# EasyEDA Pro project 4046.epro

# Schematic Schematic1
Board Name: Board1; Create Date: 2025-07-21
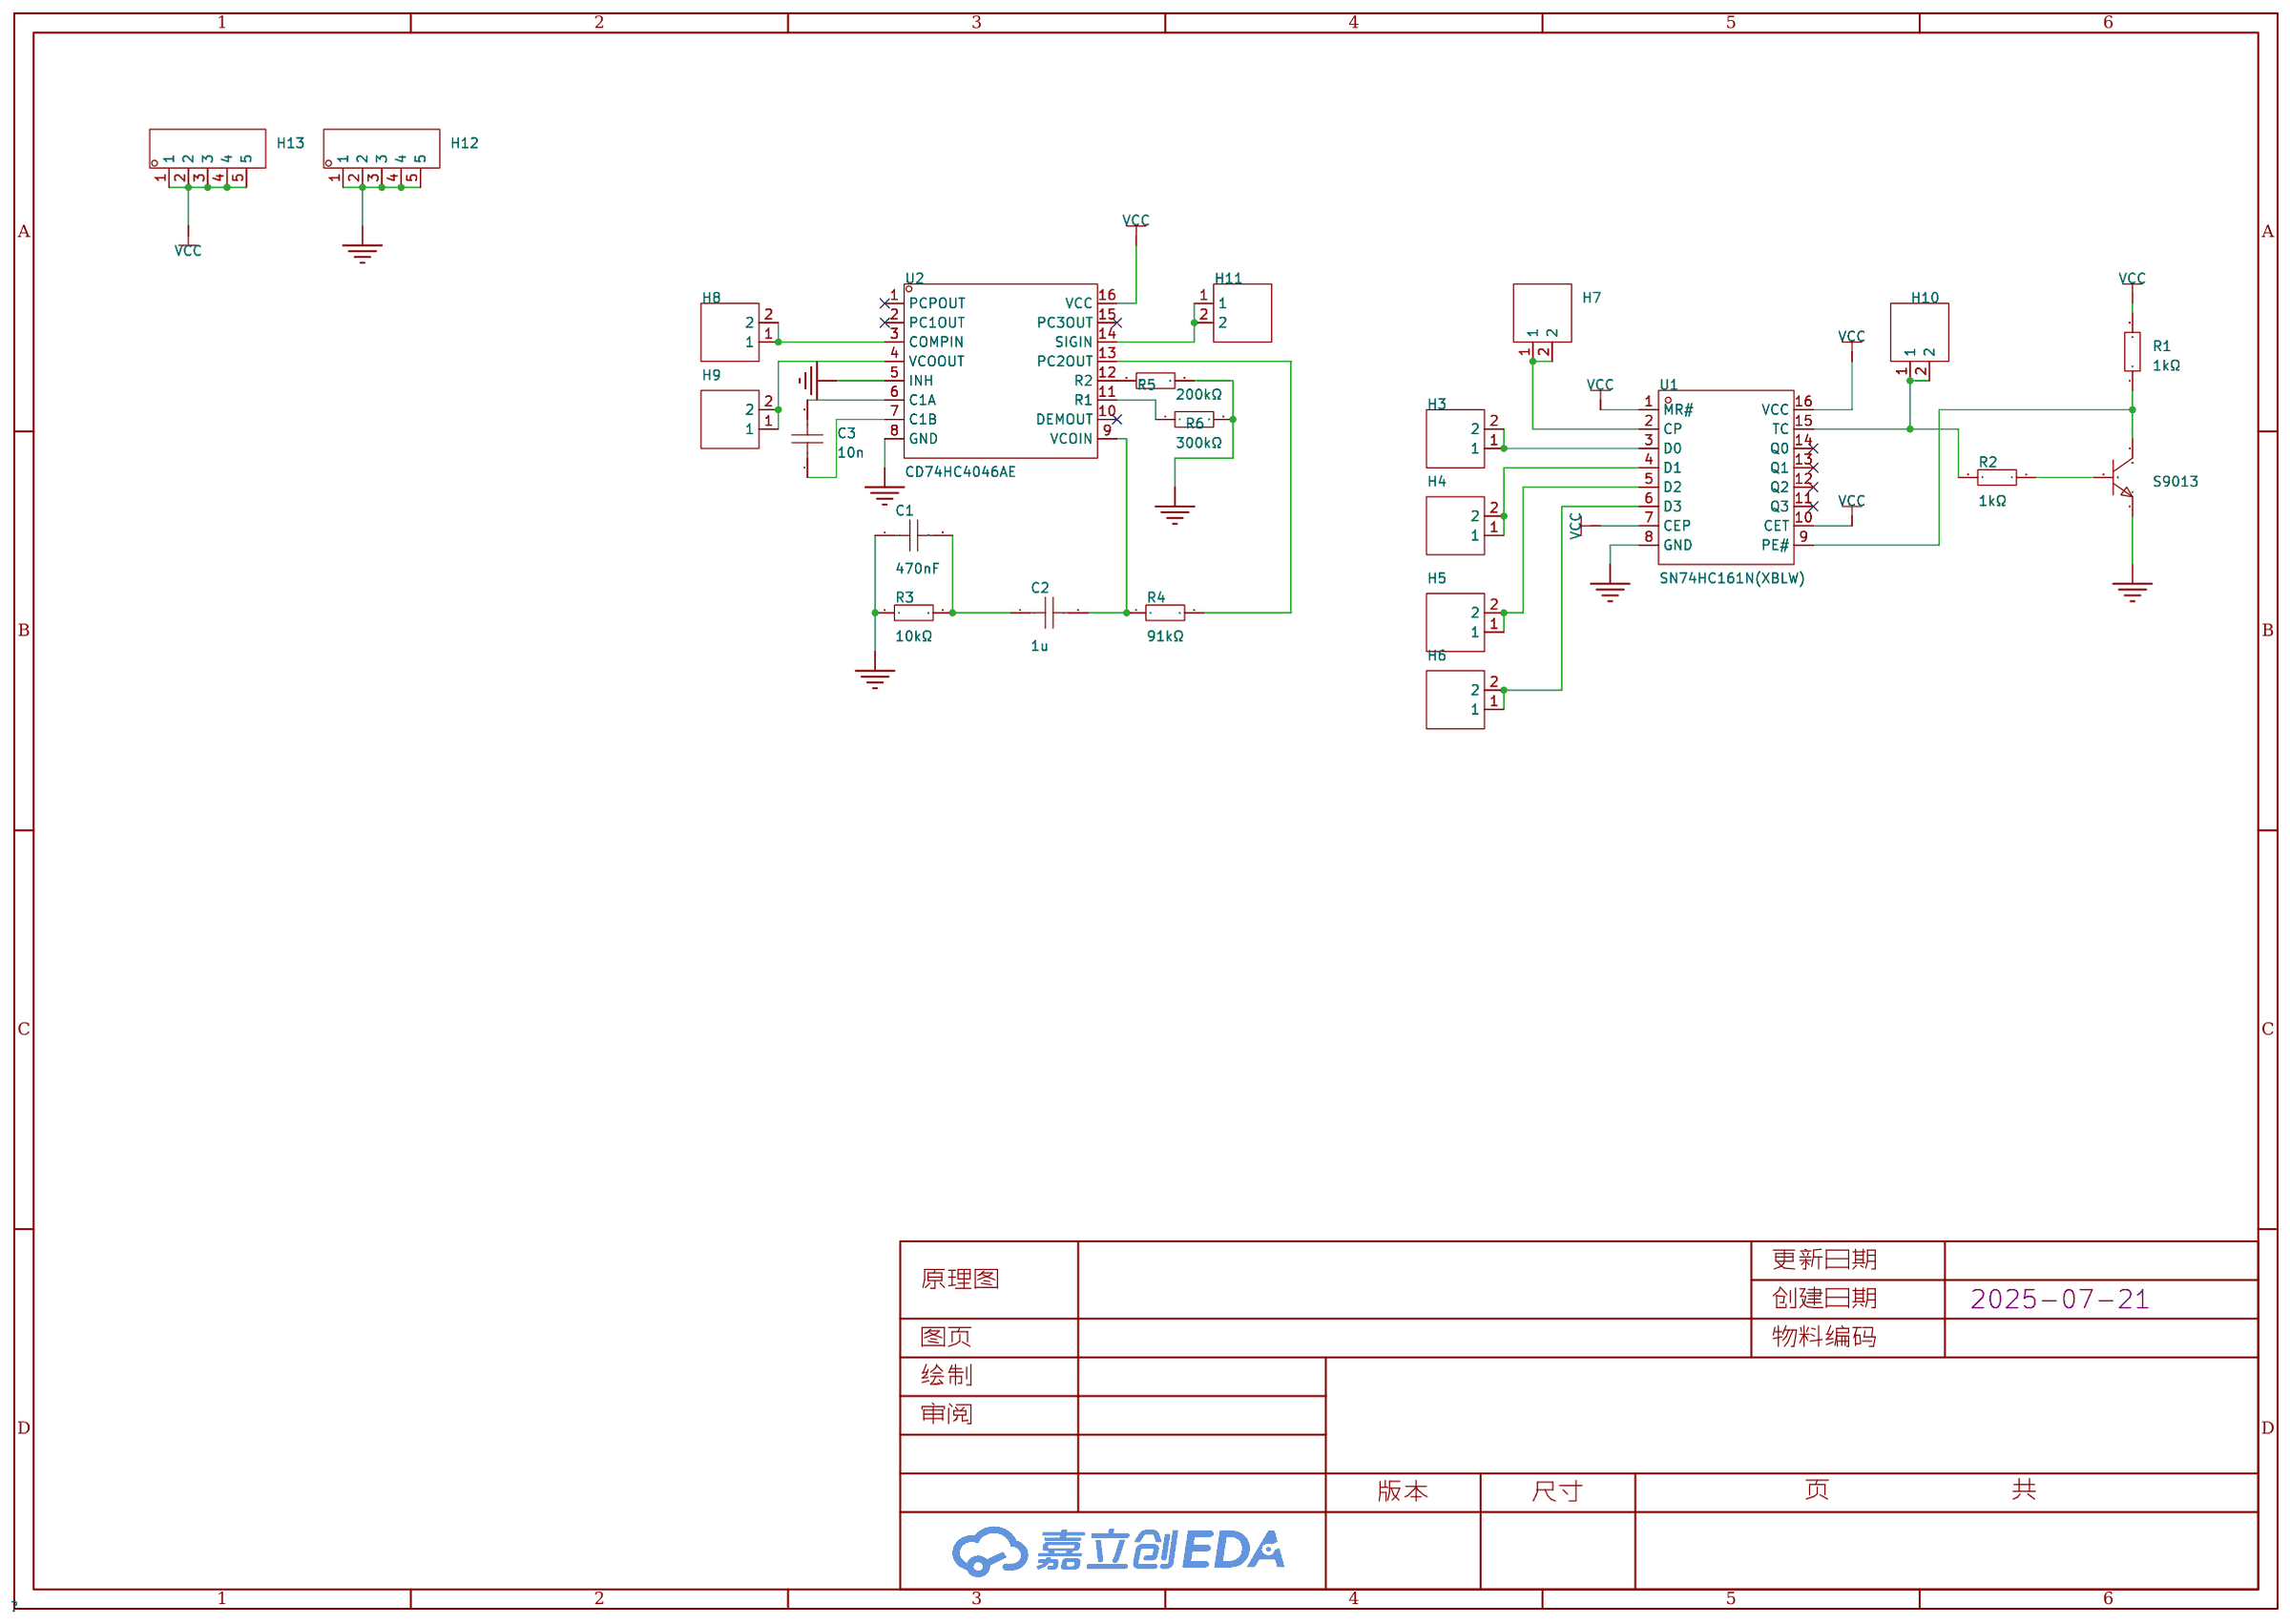
[diagram p0: schematic sheet]

## Parts
C1  470nF  [CAP-TH_L8.5-W5.0-P5.00-D1.2]
C2  1u  [CAP-TH_L8.5-W5.0-P5.00-D1.2]
C3  10n  [CAP-TH_L8.5-W5.0-P5.00-D1.2]
H3  -  [HDR-TH_2P-P2.54-V-M-1]
H4  -  [HDR-TH_2P-P2.54-V-M-1]
H5  -  [HDR-TH_2P-P2.54-V-M-1]
H6  -  [HDR-TH_2P-P2.54-V-M-1]
H7  -  [HDR-TH_2P-P2.54-V-M-1]
H8  -  [HDR-TH_2P-P2.54-V-M-1]
H9  -  [HDR-TH_2P-P2.54-V-M-1]
H10  -  [HDR-TH_2P-P2.54-V-M-1]
H11  -  [HDR-TH_2P-P2.54-V-M-1]
H12  -  [HDR-TH_5P-P2.54-V-M]
H13  -  [HDR-TH_5P-P2.54-V-M]
Q1  S9013  [TO-92-3_L4.5-W3.5-P1.27-L]
R1  1kΩ  [Res_1/8W]
R2  1kΩ  [Res_1/8W]
R3  10kΩ  [Res_1/8W]
R4  91kΩ  [Res_1/8W]
R5  200kΩ  [Res_1/8W]
R6  300kΩ  [Res_1/8W]
U1  SN74HC161N(XBLW)  [PDIP-16_L19.3-W6.4-P2.54-LS7.9-BL]
U2  CD74HC4046AE  [PDIP-16_L22.1-W6.3-P2.54-LS7.6-BL]

## Library data of the parts
C1-C3 = CT4-0805B104K500F3: 容值:100nF;精度:±10%;额定电压:50V;温度系数:X7R;; LCSC Part Name: 100nF ±10% 50V C3型（直脚）; Supplier Part: C84772; Manufacturer: FH(风华); Supplier Footprint: 插件,P=5.08mm; JLCPCB Part Class: 扩展库; Datasheet: https://atta.szlcsc.com/upload/public/pdf/source/20190402/C385200_059806A6312B28FF1421A2413EB641E1.pdf; Supplier: LCSC; Tolerance: ±10%; Voltage Rated: 50V; Temperature Coefficient: X7R
H3-H11 = HDR-M_2.54_1x2P: Supplier Part: C124375; Supplier Footprint: 插件
H12 H13 = HDR-M_2.54_1x5P: Supplier Part: C358687; Supplier Footprint: 插件
Q1 = S9013_C20616377: 晶体管类型:NPN;集电极电流(Ic):500mA;直流电流增益(hFE):300;; Supplier Part: C20616377; Manufacturer: HXY MOSFET(华轩阳电子); Supplier Footprint: TO-92; JLCPCB Part Class: 扩展库; Datasheet: https://atta.szlcsc.com/upload/public/pdf/source/20240126/4945A79BF9631635E08AA694ACEE4CD1.pdf; Supplier: LCSC; type: NPN; Current - Collector(Ic): 500mA; DC Current Gain: 300; Transition frequency(fT): 150MHz
R1-R6 = Res_AXIAL-1/8W: Supplier Footprint: 轴向引线
U1 = SN74HC161N(XBLW): 工作电压:2V~6V;触发沿:上升沿;计数速率:48MHz;; LCSC Part Name: SN74HC161N; Supplier Part: C18723509; Manufacturer: XBLW(芯伯乐); Supplier Footprint: DIP-16; JLCPCB Part Class: 扩展库; Datasheet: https://atta.szlcsc.com/upload/public/pdf/source/20231019/E4ACCDE238F6D312E2887AAFD4BE47C0.pdf; Supplier: LCSC; Supply Voltage: 2V~6V; Trigger Type: 上升沿; Reset Style: 异步; Timing mode: 同步; Count Rate: 48MHz; Operating Temperature: -40℃~+105℃
U2 = CD74HC4046AE: 最大输出频率:38MHz;输出通道数:3;; LCSC Part Name: IC PLL W/VCO; Supplier Part: C354049; Manufacturer: TI(德州仪器); Supplier Footprint: PDIP-16; JLCPCB Part Class: 扩展库; Datasheet: https://www.ti.com/cn/lit/gpn/cd74hc4046a; Supplier: LCSC; Output Frequency(Max): 38MHz; Voltage - Supply: 2V~6V; Number of Outputs: 3; Operating Temperature: -55℃~+125℃

## Nets
GND: C1.1 H12.1 H12.2 H12.3 H12.4 H12.5 Q1.1(E) R3.1 R5.2 R6.2 U1.8(GND) U2.5(INH) U2.8(GND)
VCC: H13.1 H13.2 H13.3 H13.4 H13.5 R1.2 U1.1(MR#) U1.7(CEP) U1.10(CET) U1.16(VCC) U2.16(VCC)
$1N550: H3.1 H3.2 U1.3(D0)
$1N554: H4.1 H4.2 U1.4(D1)
$1N559: H5.1 H5.2 U1.5(D2)
$1N564: H6.1 H6.2 U1.6(D3)
$1N946: Q1.3(C) R1.1 U1.9(PE#)
$1N974: H10.1 H10.2 R2.2 U1.15(TC)
$1N1282: H7.1 H7.2 U1.2(CP)
$1N1371: H9.1 H9.2 U2.4(VCOOUT)
$1N1385: H8.1 H8.2 U2.3(COMPIN)
$1N1463: Q1.2(B) R2.1
$1N1636: C1.2 C2.1 R3.2
$1N1677: C2.2 R4.1 U2.9(VCOIN)
$1N1708: R4.2 U2.13(PC2OUT)
$1N1750: C3.2 U2.6(C1A)
$1N1754: C3.1 U2.7(C1B)
$1N1820: R5.1 U2.12(R2)
$1N1896: R6.1 U2.11(R1)
$1N1954: H11.1 H11.2 U2.14(SIGIN)

Not connected (* = marked no-connect by the designer): U1 11(Q3)* 12(Q2)* 13(Q1)* 14(Q0)*; U2 1(PCPOUT)* 2(PC1OUT)* 10(DEMOUT)* 15(PC3OUT)*

# Board PCB1
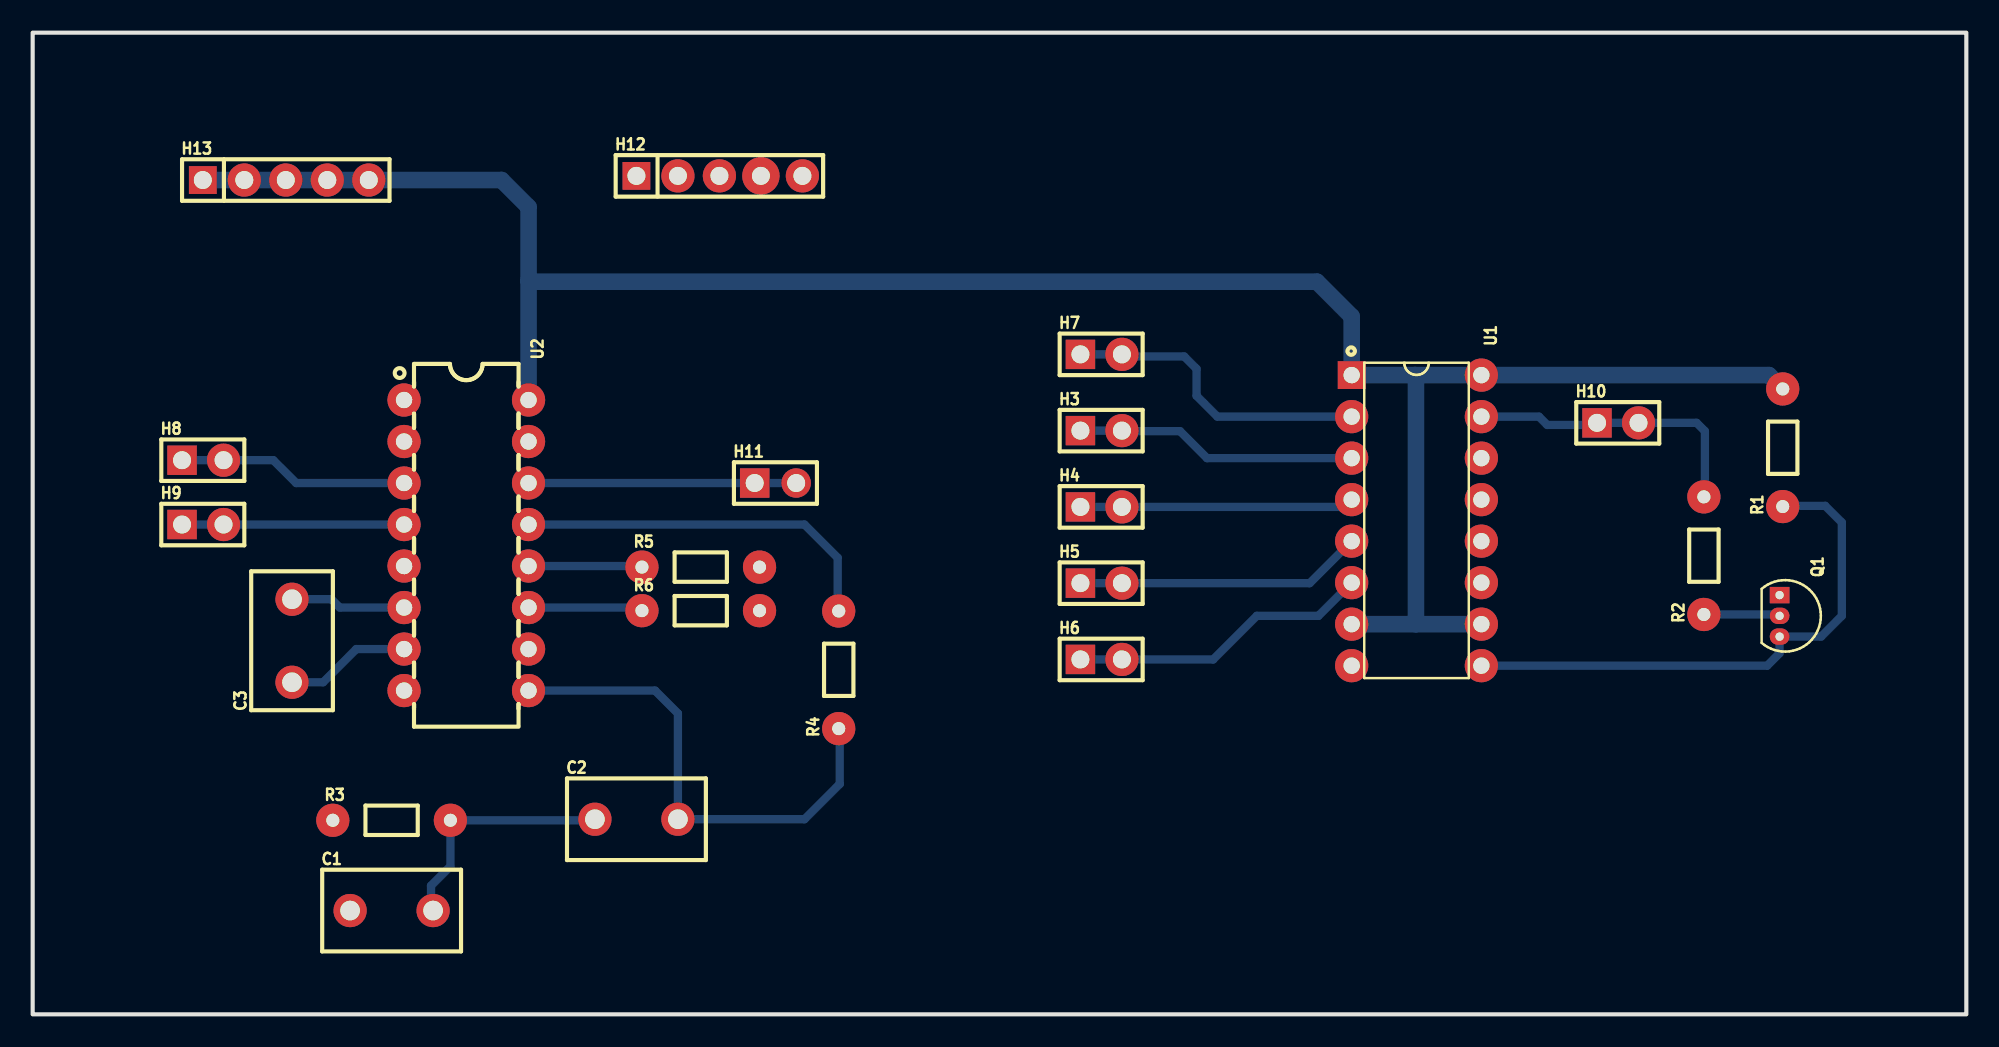
[diagram p1: board, top side]
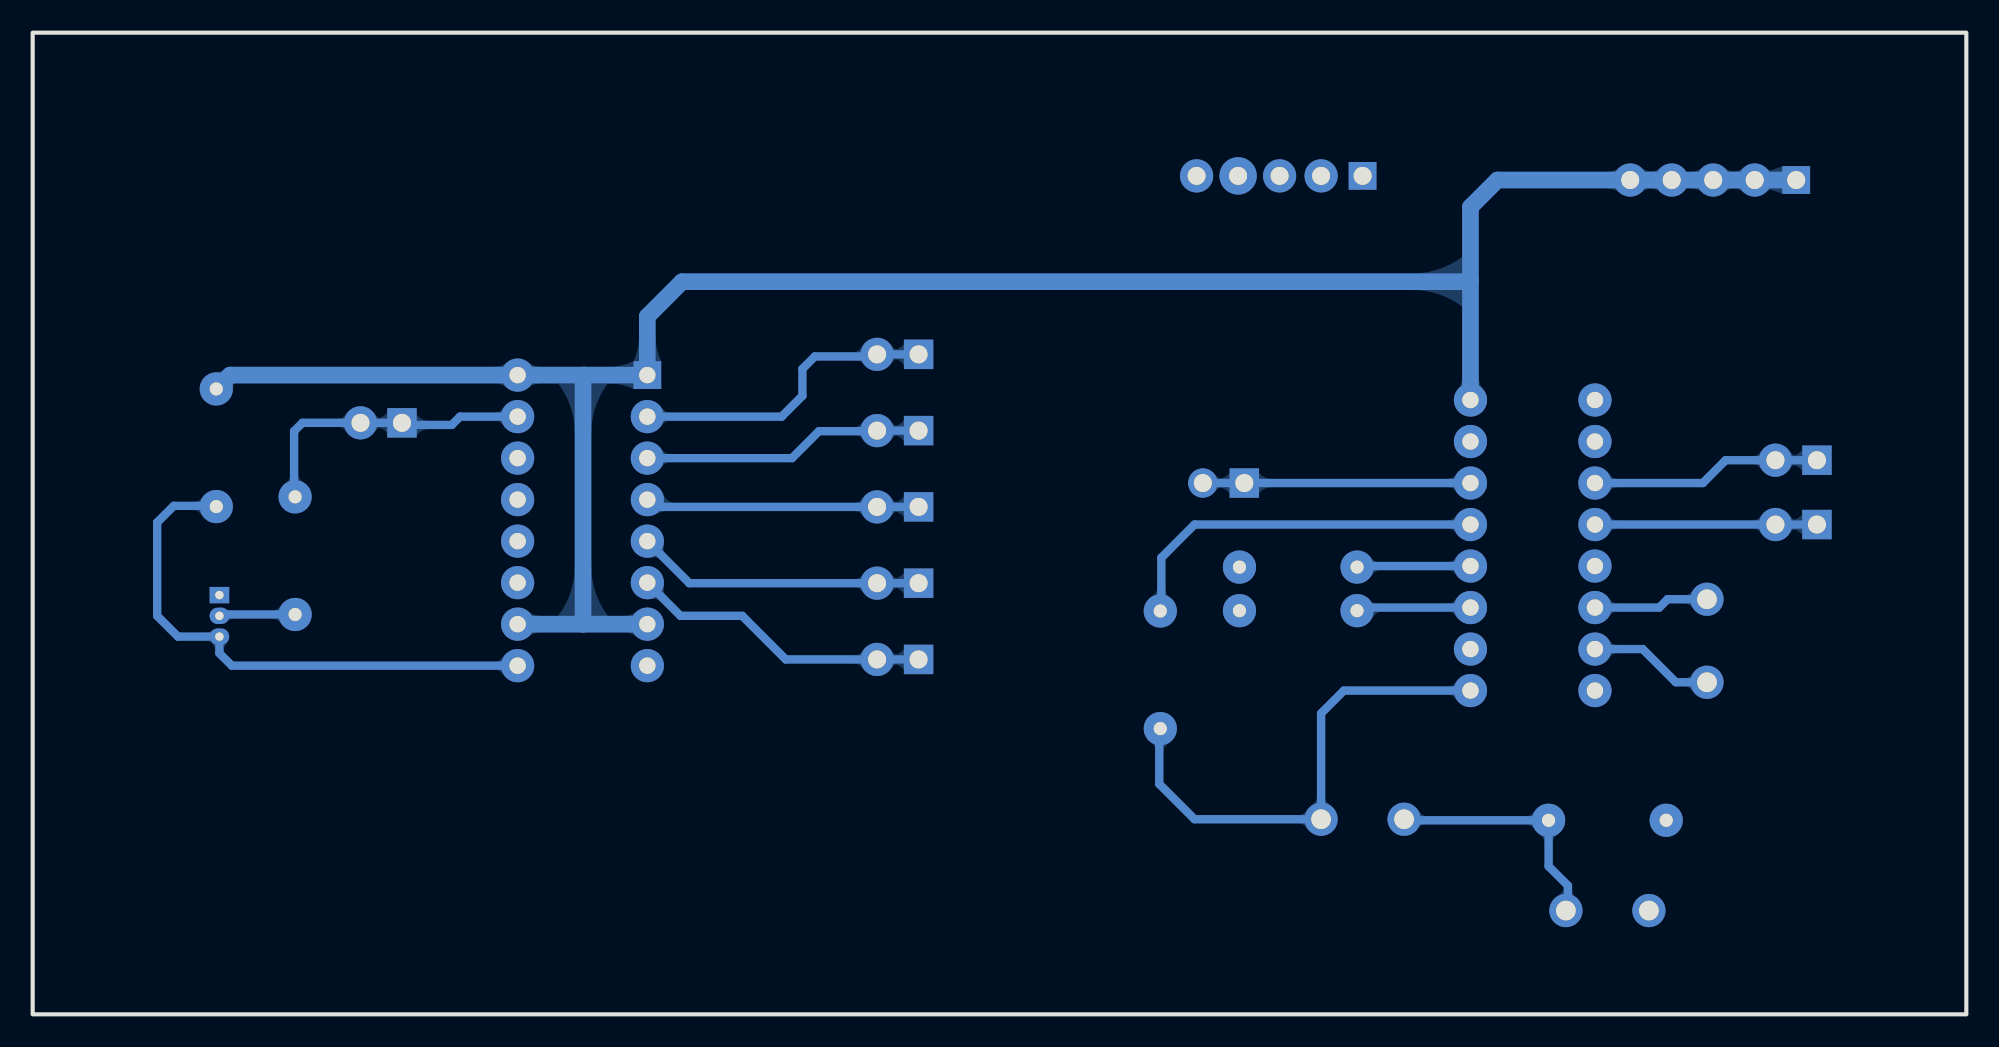
[diagram p2: board, bottom side, seen from below]

Outline 118.36 x 60.07 mm; copper layers: Top Layer, Bottom Layer. Coordinates in mm from the lower left corner of the outline.
Outline path: rectangle 0,60.07 118.36,0
Stack: Top Layer 0.035mm / Dielectric1 1.51mm FR4 er 4.5 / Bottom Layer 0.035mm

## Design rules (mm)
template: 自定义配置
spacing copperThickness1oz (default): track to track 0.102, other pairs 0.152 to 0.3
spacing copperThickness2oz: track to track 0.203, other pairs 0.152 to 0.3
track width copperThickness1oz (default): min 0.127, default 0.254, max 2.54
track width copperThickness2oz: min 0.203, default 0.254, max 2.54
differential pair differentialPair (default): width min 0.127, default 0.254, max 2.54; gap min 0.152, default 0.152
via viaSize (default): diameter min 0.5, default 0.61, max 10; hole min 0.3, default 0.305, max 6.3

## Placement (name value [footprint] x y rotation side)
C1  470nF  [CAP-TH_L8.5-W5.0-P5.00-D1.2]  21.97 6.35 0 top
C2  1u  [CAP-TH_L8.5-W5.0-P5.00-D1.2]  36.96 11.94 0 top
C3  10n  [CAP-TH_L8.5-W5.0-P5.00-D1.2]  15.88 22.86 90 top
H3  -  [HDR-TH_2P-P2.54-V-M-1]  65.4 35.72 0 top
H4  -  [HDR-TH_2P-P2.54-V-M-1]  65.4 31.05 0 top
H5  -  [HDR-TH_2P-P2.54-V-M-1]  65.4 26.38 0 top
H6  -  [HDR-TH_2P-P2.54-V-M-1]  65.4 21.72 0 top
H7  -  [HDR-TH_2P-P2.54-V-M-1]  65.4 40.39 0 top
H8  -  [HDR-TH_2P-P2.54-V-M-1]  10.41 33.91 0 top
H9  -  [HDR-TH_2P-P2.54-V-M-1]  10.41 29.97 0 top
H10  -  [HDR-TH_2P-P2.54-V-M-1]  97.03 36.2 0 top
H11  -  [HDR-TH_2P-P2.54-V-M-1#2]  45.47 32.51 0 top
H12  -  [HDR-TH_5P-P2.54-V-M#2]  42.04 51.31 0 top
H13  -  [HDR-TH_5P-P2.54-V-M]  15.49 51.05 0 top
Q1  S9013  [TO-92-3_L4.5-W3.5-P1.27-L]  106.93 24.38 270 top
R1  1kΩ  [Res_1/8W]  107.19 34.67 90 top
R2  1kΩ  [Res_1/8W]  102.36 28.07 90 top
R3  10kΩ  [Res_1/8W]  21.97 11.81 0 top
R4  91kΩ  [Res_1/8W]  49.4 21.08 90 top
R5  200kΩ  [Res_1/8W]  40.89 27.31 0 top
R6  300kΩ  [Res_1/8W]  40.89 24.64 0 top
U1  SN74HC161N(XBLW)  [PDIP-16_L19.3-W6.4-P2.54-LS7.9-BL]  84.71 30.23 270 top
U2  CD74HC4046AE  [PDIP-16_L22.1-W6.3-P2.54-LS7.6-BL]  26.54 28.7 270 top

## Footprints (pads in the part's own frame, mm; a bottom-side part is the same pattern mirrored in y, then rotated)
CAP-TH_L8.5-W5.0-P5.00-D1.2
  round 2.032 hole 1.2x0.762: 1(-2.54,0) 2(2.54,0)
HDR-TH_2P-P2.54-V-M-1
  rect 1.8x1.8 hole 1.1: 1(-1.27,0)
  round 2.032 hole 1.1x0.762: 2(1.27,0)
HDR-TH_2P-P2.54-V-M-1#2
  rect 1.8x1.8 hole 1.1: 1(-1.27,0)
  round 1.8 hole 1.1: 2(1.27,0)
HDR-TH_5P-P2.54-V-M
  rect 1.7x1.7 hole 1.1x0.762: 1(-5.08,0)
  round 2.032 hole 1.1x0.762: 2(-2.54,0) 3(0,0) 4(2.54,0) 5(5.08,0)
HDR-TH_5P-P2.54-V-M#2
  rect 1.7x1.7 hole 1.1x0.762: 1(-5.08,0)
  round 2.032 hole 1.1x0.762: 2(-2.54,0) 3(0,0) 5(5.08,0)
  round 2.286 hole 1.1x0.762: 4(2.54,0)
PDIP-16_L19.3-W6.4-P2.54-LS7.9-BL
  rect 1.7x1.7 hole 1: 1(-8.89,-3.97)
  round 2.032 hole 0.762x1: 2(-6.35,-3.97) 3(-3.81,-3.97) 4(-1.27,-3.97) 5(1.27,-3.97) 6(3.81,-3.97) 7(6.35,-3.97) 8(8.89,-3.97) 9(8.89,3.97) 10(6.35,3.97) 11(3.81,3.97) 12(1.27,3.97) 13(-1.27,3.97) 14(-3.81,3.97) 15(-6.35,3.97) 16(-8.89,3.97)
PDIP-16_L22.1-W6.3-P2.54-LS7.6-BL
  round 2.032 hole 0.762x1: 1(-8.89,-3.81) 2(-6.35,-3.81) 3(-3.81,-3.81) 4(-1.27,-3.81) 5(1.27,-3.81) 6(3.81,-3.81) 7(6.35,-3.81) 8(8.89,-3.81) 9(8.89,3.81) 10(6.35,3.81) 11(3.81,3.81) 12(1.27,3.81) 13(-1.27,3.81) 14(-3.81,3.81) 15(-6.35,3.81) 16(-8.89,3.81)
Res_1/8W
  round 2.032 hole 0.8x0.762: 1(-3.599,0.063) 2(3.599,0.063)
TO-92-3_L4.5-W3.5-P1.27-L
  rect 1x1.2 hole 0.508: 1(-1.27,0)
  oval 1x1.2 hole 0.508: 2(0,0) 3(1.27,0)

## Nets
As in the schematic.

Pads without a net: U1 11 12 13 14; U2 1 2 10 15

## Routing (per net, layer and track width the routed paths; a pad name or vN(x,y) marks a point on that pad's centre or on a via; arc(x,y) is an arc through that point)
VCC: length 137.4
  Bottom Layer w1.016: 84.61,39.12 U1.16 106.28,39.12 R1.2 ; 84.61,39.12 84.67,39.05 84.67,23.88 ; 84.61,39.12 U1.1 80.74,42.71 78.61,44.83 30.41,44.83 30.35,44.89 ; 84.67,23.88 U1.7 ; 84.67,23.88 U1.10 ; H13.3 H13.2 H13.1 ; 30.35,44.89 U2.16 ; 30.35,44.89 30.35,49.4 28.7,51.05 H13.5 H13.4 15.75,51.05 15.49,50.8
$1N550: length 17.3
  Bottom Layer w0.508: H3.1 H3.2 66.71,35.69 70.23,35.69 71.88,34.04 U1.3
$1N554: length 16.8
  Bottom Layer w0.508: H4.1 H4.2 80.29,31.05 U1.4
$1N559: length 17.7
  Bottom Layer w0.508: U1.5 78.17,26.38 H5.2 H5.1
$1N564: length 18.6
  Bottom Layer w0.508: H6.1 H6.2 72.26,21.72 74.93,24.38 78.71,24.38 U1.6
$1N946: length 33.7
  Bottom Layer w0.508: U1.9 106.17,21.34 106.93,22.1 Q1.3 109.47,23.11 110.74,24.38 110.74,30.1 109.73,31.12 107.17,31.12 R1.1
$1N974: length 18.5
  Bottom Layer w0.508: U1.15 92.2,36.58 92.71,36.07 95.63,36.07 H10.1 ; 95.63,35.81 96.01,36.2 H10.2 101.85,36.2 102.36,35.69 102.36,31.73 R2.2
$1N1282: length 19.1
  Bottom Layer w0.508: U1.2 72.52,36.58 71.25,37.85 71.25,39.5 70.48,40.26 66.8,40.26 H7.2 H7.1
$1N1371: length 13.6
  Bottom Layer w0.508: U2.4 H9.2 9.14,29.97
$1N1385: length 14.2
  Bottom Layer w0.508: 9.14,33.91 H8.2 14.73,33.91 16.13,32.51 U2.3
$1N1463: length 4.7
  Bottom Layer w0.508: R2.1 106.85,24.47 Q1.2
$1N1636: length 14.9
  Bottom Layer w0.508: C2.1 34.35,11.87 R3.2 25.57,9.06 24.38,7.87 24.38,6.48 C1.2
$1N1677: length 30.4
  Bottom Layer w0.508: 49.34,17.48 49.4,17.42 49.4,14.1 47.24,11.94 C2.2 39.5,18.42 38.1,19.81 U2.9
$1N1708: length 23.1
  Bottom Layer w0.508: U2.13 47.24,29.97 49.28,27.94 49.28,24.75 49.34,24.68
$1N1750: length 7.1
  Bottom Layer w0.508: U2.6 18.8,24.89 18.29,25.4 C3.2
$1N1754: length 7.7
  Bottom Layer w0.508: U2.7 19.81,22.35 17.78,20.32 C3.1
$1N1820: length 7
  Bottom Layer w0.508: U2.12 37.23,27.43 R5.1
$1N1896: length 7
  Bottom Layer w0.508: R6.1 37.1,24.89 U2.11
$1N1954: length 16.4
  Bottom Layer w0.508: H11.2 H11.1 U2.14

Small or netless copper shapes (teardrops, artwork), in the pictures only: 81 on Bottom Layer
